# Altium schematic sheet PCI short card universal - 32 BIT-3.schdoc
size A3
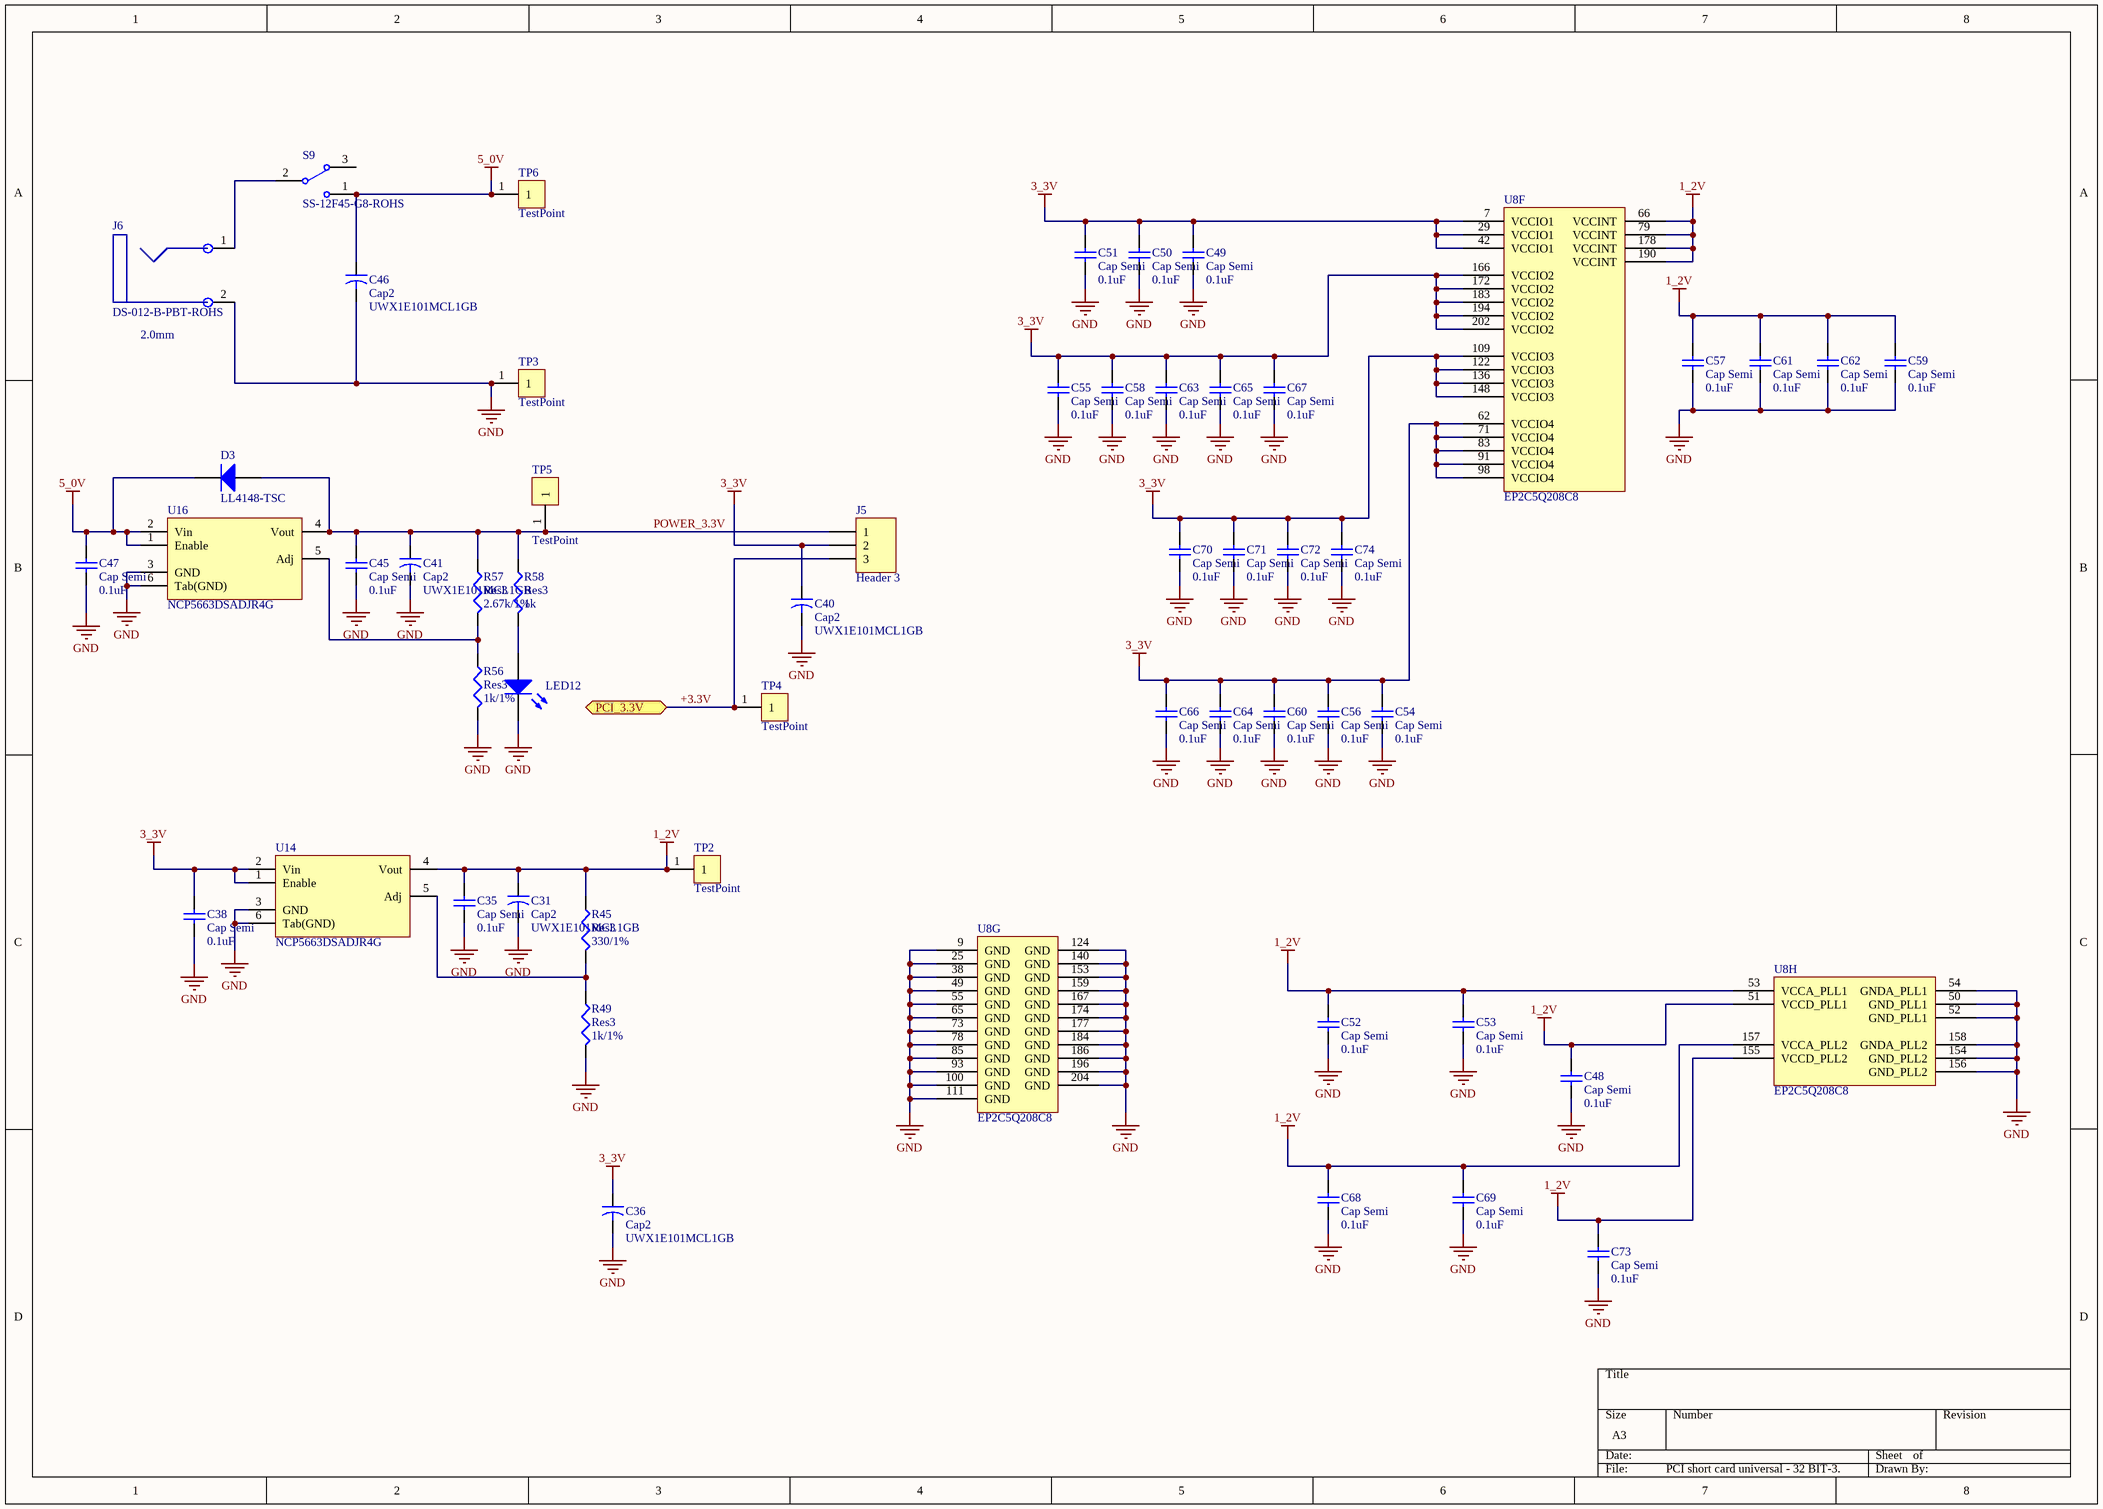
[diagram p0: PCI short card universal - 32 BIT-3.schdoc]

## Parts
C31  Cap2  value UWX1E101MCL1GB  [ECEL_D8]
C35  Cap Semi  value 0.1uF  [RESC1608N]
C36  Cap2  value UWX1E101MCL1GB  [ECEL_D8]
C38  Cap Semi  value 0.1uF  [RESC1608N]
C40  Cap2  value UWX1E101MCL1GB  [ECEL_D8]
C41  Cap2  value UWX1E101MCL1GB  [ECEL_D8]
C45  Cap Semi  value 0.1uF  [RESC1608N]
C46  Cap2  value UWX1E101MCL1GB  [ECEL_D8]
C47  Cap Semi  value 0.1uF  [RESC1608N]
C48  Cap Semi  value 0.1uF  [RESC1608N]
C49  Cap Semi  value 0.1uF  [RESC1608N]
C50  Cap Semi  value 0.1uF  [RESC1608N]
C51  Cap Semi  value 0.1uF  [RESC1608N]
C52  Cap Semi  value 0.1uF  [RESC1608N]
C53  Cap Semi  value 0.1uF  [RESC1608N]
C54  Cap Semi  value 0.1uF  [RESC1608N]
C55  Cap Semi  value 0.1uF  [RESC1608N]
C56  Cap Semi  value 0.1uF  [RESC1608N]
C57  Cap Semi  value 0.1uF  [RESC1608N]
C58  Cap Semi  value 0.1uF  [RESC1608N]
C59  Cap Semi  value 0.1uF  [RESC1608N]
C60  Cap Semi  value 0.1uF  [RESC1608N]
C61  Cap Semi  value 0.1uF  [RESC1608N]
C62  Cap Semi  value 0.1uF  [RESC1608N]
C63  Cap Semi  value 0.1uF  [RESC1608N]
C64  Cap Semi  value 0.1uF  [RESC1608N]
C65  Cap Semi  value 0.1uF  [RESC1608N]
C66  Cap Semi  value 0.1uF  [RESC1608N]
C67  Cap Semi  value 0.1uF  [RESC1608N]
C68  Cap Semi  value 0.1uF  [RESC1608N]
C69  Cap Semi  value 0.1uF  [RESC1608N]
C70  Cap Semi  value 0.1uF  [RESC1608N]
C71  Cap Semi  value 0.1uF  [RESC1608N]
C72  Cap Semi  value 0.1uF  [RESC1608N]
C73  Cap Semi  value 0.1uF  [RESC1608N]
C74  Cap Semi  value 0.1uF  [RESC1608N]
D3  LL4148-TSC  [SOD80C]
J5  Header 3  [HDR1X3]
J6  DS-012-B-PBT-ROHS  [JACK]
LED12  LED2  [LED3.2X1.6X1.1]  (value not drawn)
R45  Res3  value 330/1%  [RESC1608N]
R49  Res3  value 1k/1%  [RESC1608N]
R56  Res3  value 1k/1%  [RESC1608N]
R57  Res3  value 2.67k/1%  [RESC1608N]
R58  Res3  value 1k  [RESC1608N]
S9  SS-12F45-G8-ROHS  [SLIDE_SW_2TYPE]
TP2  TestPoint  [HDR1X1]
TP3  TestPoint  [HDR1X1]
TP4  TestPoint  [HDR1X1]
TP5  TestPoint  [HDR1X1]
TP6  TestPoint  [HDR1X1]
U8  EP2C5Q208C8  [PQFP208_N]  (parts F,G,H of 9)
U14  NCP5663DSADJR4G  [D2PAK(936AA)]
U16  NCP5663DSADJR4G  [D2PAK(936AA)]

## Ports
PCI_3.3V

## Nets
1_2V: C31.1 C35.2 C48.2 C52.2 C53.2 C57.2 C59.2 C61.2 C62.2 C68.2 C69.2 C73.2 R45.1 TP2.1 U8.51(VCCD_PLL1) U8.53(VCCA_PLL1) U8.66(VCCINT) U8.79(VCCINT) U8.155(VCCD_PLL2) U8.157(VCCA_PLL2) U8.178(VCCINT) U8.190(VCCINT) U14.4(Vout)
3_3V: C36.1 C38.2 C40.1 C49.2 C50.2 C51.2 C54.2 C55.2 C56.2 C58.2 C60.2 C63.2 C64.2 C65.2 C66.2 C67.2 C70.2 C71.2 C72.2 C74.2 J5.2 U8.7(VCCIO1) U8.29(VCCIO1) U8.42(VCCIO1) U8.62(VCCIO4) U8.71(VCCIO4) U8.83(VCCIO4) U8.91(VCCIO4) U8.98(VCCIO4) U8.109(VCCIO3) U8.122(VCCIO3) U8.136(VCCIO3) U8.148(VCCIO3) U8.166(VCCIO2) U8.172(VCCIO2) U8.183(VCCIO2) U8.194(VCCIO2) U8.202(VCCIO2) U14.1(Enable) U14.2(Vin)
5_0V: C46.1 C47.2 D3.2(K) S9.1 TP6.1 U16.1(Enable) U16.2(Vin)
GND: C31.2 C35.1 C36.2 C38.1 C40.2 C41.2 C45.1 C46.2 C47.1 C48.1 C49.1 C50.1 C51.1 C52.1 C53.1 C54.1 C55.1 C56.1 C57.1 C58.1 C59.1 C60.1 C61.1 C62.1 C63.1 C64.1 C65.1 C66.1 C67.1 C68.1 C69.1 C70.1 C71.1 C72.1 C73.1 C74.1 J6.2 LED12.2(K) R49.2 R56.2 TP3.1 U8.9(GND) U8.25(GND) U8.38(GND) U8.49(GND) U8.50(GND_PLL1) U8.52(GND_PLL1) U8.54(GNDA_PLL1) U8.55(GND) U8.65(GND) U8.73(GND) U8.78(GND) U8.85(GND) U8.93(GND) U8.100(GND) U8.111(GND) U8.124(GND) U8.140(GND) U8.153(GND) U8.154(GND_PLL2) U8.156(GND_PLL2) U8.158(GNDA_PLL2) U8.159(GND) U8.167(GND) U8.174(GND) U8.177(GND) U8.184(GND) U8.186(GND) U8.196(GND) U8.204(GND) U14.3(GND) U14.6(Tab(GND)) U16.3(GND) U16.6(Tab(GND))
+3.3V: J5.3 TP4.1 ; port PCI_3.3V
POWER_3.3V: C41.1 C45.2 D3.1(A) J5.1 R57.1 R58.1 TP5.1 U16.4(Vout)
NetJ6_1: J6.1 S9.2
NetLED12_1: LED12.1(A) R58.2
NetR45_2: R45.2 R49.1 U14.5(Adj)
NetR56_1: R56.1 R57.2 U16.5(Adj)

Not connected (* = marked no-connect by the designer): S9 3

## Notes on the sheet
- (near J6) 2.0mm

## Library data of the parts
C31 C36 C40 C41 C46 = Cap2: NICHICON; Published: 23-Sep-2002; PackageReference: CAPR5-4X5; Publisher: Altium Limited
C35 C38 C45 C47-C74 = Cap Semi: Capacitor (Semiconductor SIM Model); Published: 8-Jun-2000; LatestRevisionDate: 17-Jul-2002; LatestRevisionNote: Re-released for DXP Platform.; PackageReference: C1206; Publisher: Altium Limited
D3 = BAS32L: TAIWAN SEMICONDUCTOR; Published: 17-Sep-2003; LatestRevisionDate: 19-Mar-2004; LatestRevisionNote: Silkscreen size reduced.; DatasheetVersion: 23-Jan-2002; PackageVersion: Jan-2002; PackageReference: SOD80C; Publisher: Altium Limited; PackageDescription: Metal Electrode Face (MELF) Diode; Body 3.5 x 1.6 mm (LxDia); ComponentLink1Description: Manufacturer Link; ComponentLink1URL: http://www.semiconductors.philips.com/; ComponentLink2Description: Datasheet; ComponentLink2URL: http://www.semiconductors.philips.com/acrobat/datasheets/BAS32L_4.pdf
J5 = Header 3: Header, 3-Pin; LatestRevisionDate: 17-Jul-2002; LatestRevisionNote: Re-released for DXP Platform.; Publisher: Altium Limited
J6 = JACK2.5mm: WEALTH METAL
LED12 = LED2: OASISTEK (TO-3216BC-MAE); Published: 8-Jun-2000; LatestRevisionDate: 17-Jul-2002; LatestRevisionNote: Re-released for DXP Platform.; PackageDocument: Feb-2002; PackageReference: 3.2X1.6X1.1; Publisher: Altium Limited
R45 R49 R56-R58 = Res3: Resistor; Published: 8-Jun-2000; LatestRevisionDate: 04-Mar-2005; LatestRevisionNote: PCB Footprint replaced.; PackageReference: J1-0603; Publisher: Altium Limited
S9 = SW-SPDT: WEALTH METAL; Published: 24-Mar-1999; LatestRevisionDate: 17-Dec-2003; LatestRevisionNote: Schematic revised, PCB Footprint replaced.; DatasheetDocument: 05-Dec-2000; PackageReference: TL36WW15050; Publisher: Altium Limited; ComponentLink1Description: Manufacturer Link; ComponentLink1URL: http://www.apem.com
U8 = EP2C5Q208C8: ALTERA Cyclone II Family, 1.2V FPGA, 142 I/O Pins, 2 PLLs, 208-Pin PQFP, Speed Grade 8, Commercial Grade; Note: DQS signal pins named according to DQ bus modes.  "/" separates each mode. ie. Modes x8/x9 / Modes x16/x18.; Published: 4-Mar-2005; LatestRevisionDate: 13-Apr-2006; LatestRevisionNote: IPC-7351 Footprint Added.; DatasheetVersion: ver2.3, Mar-2006; PackageVersion: ver14.2, Oct-2005; PackageReference: PQFP208; Publisher: Altium Limited; PackageDescription: 208-Pin Plastic Quad Flat Pack (PQFP208); Code_JEDEC: MS-029-FA-1; ComponentLink1Description: Manufacturer Link; ComponentLink1URL: http://www.altera.com/products/devices/cyclone2/cy2-index.jsp; ComponentLink2Description: Handbook; ComponentLink2URL: http://www.altera.com/literature/hb/cyc2/cyc2_cii5v1.pdf; ComponentLink3Description: Packaging Specification; ComponentLink3URL: http://www.altera.com/literature/ds/dspkg.pdf
U14 U16 = NCP5663DSADJR4G: ON SEMI